# EAGLE schematic MAXREFDES98_Schematic (EAGLE 9.6.2)
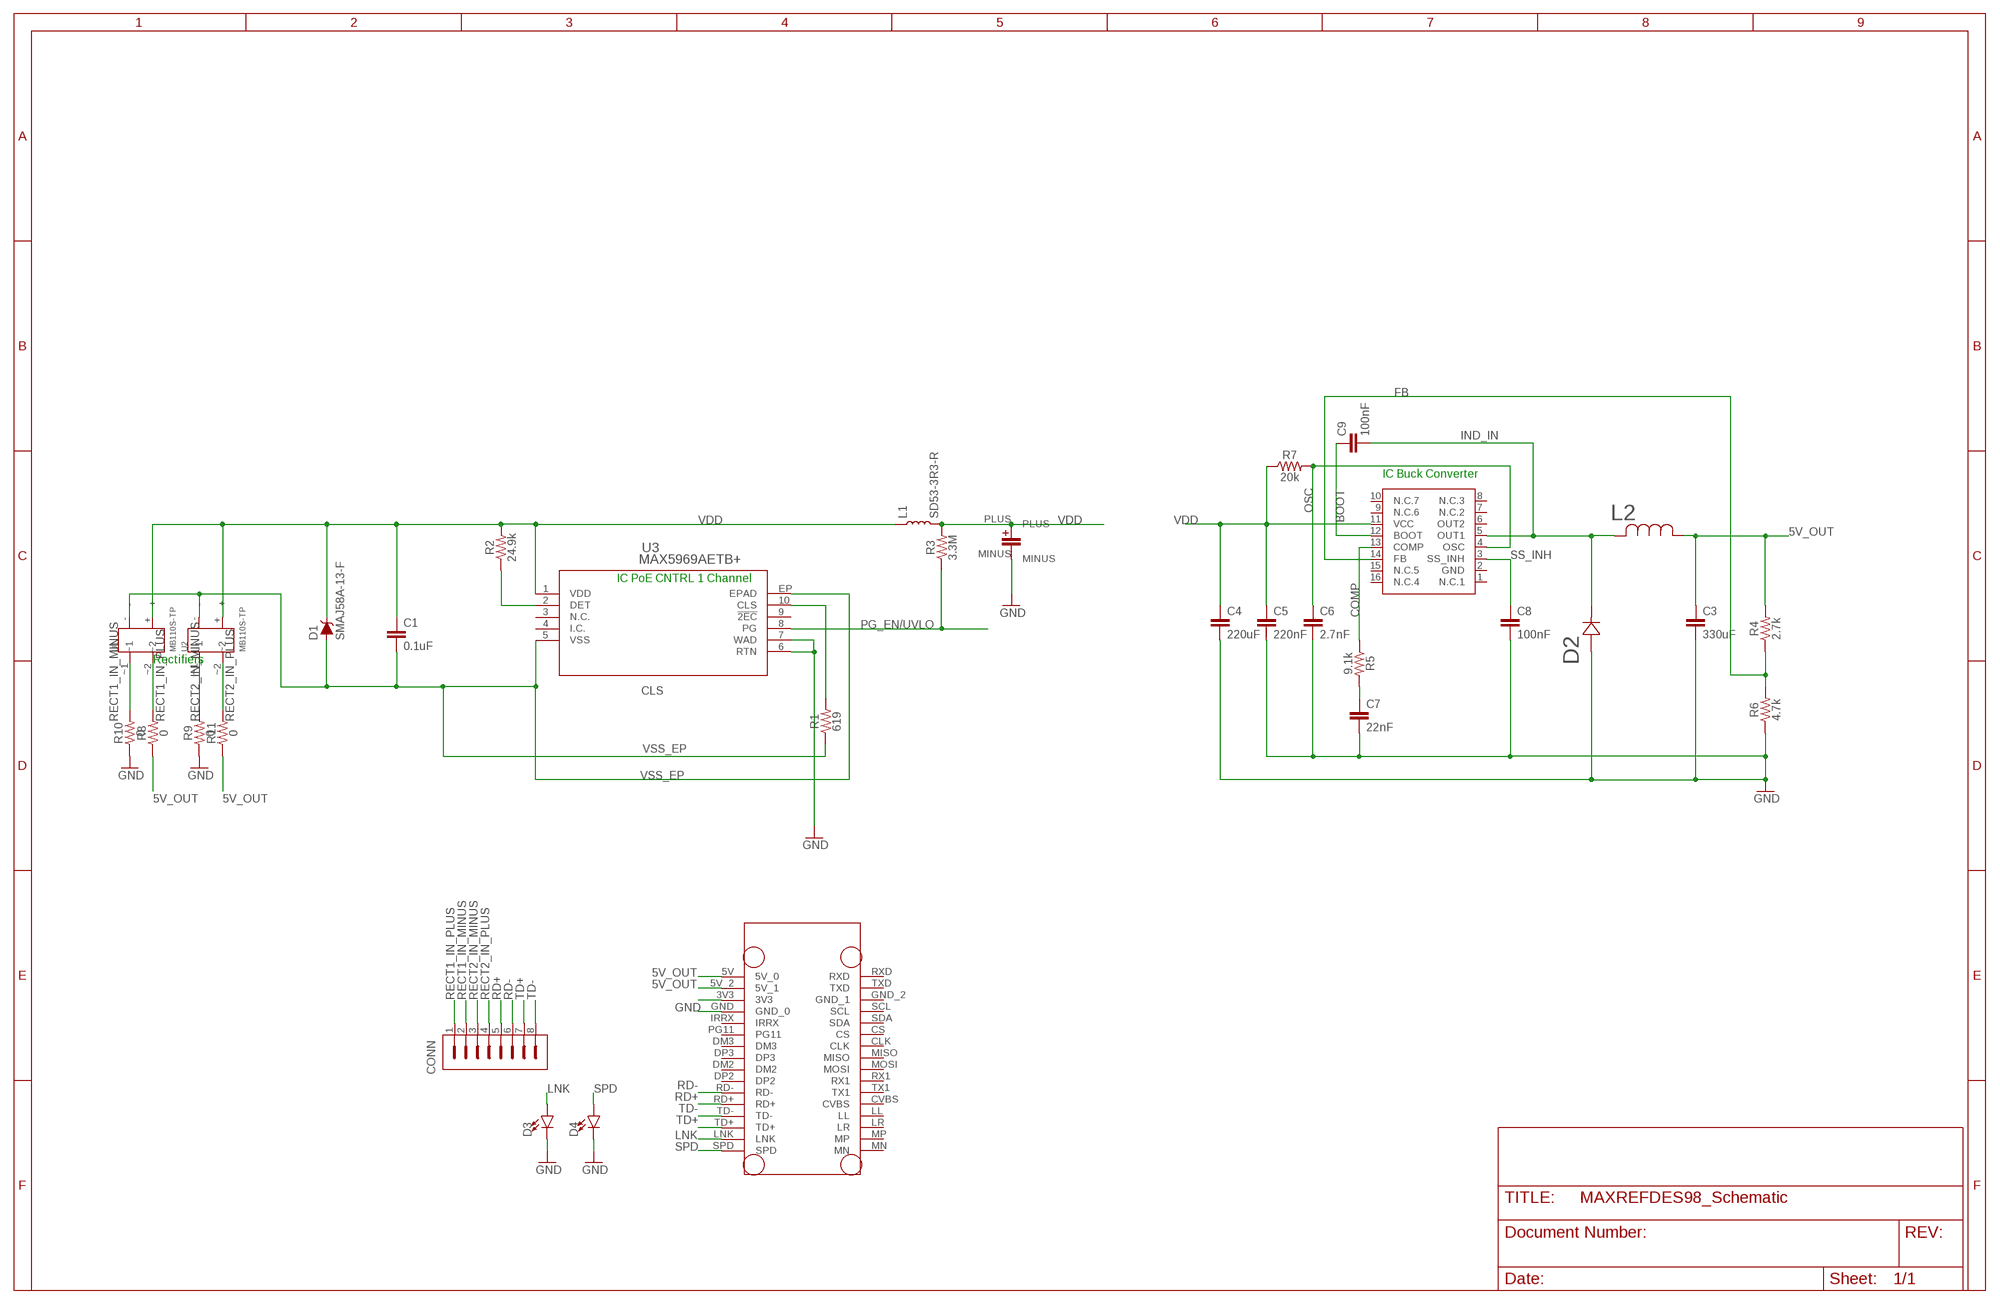
[diagram p0: schematic, sheet 1]

## Parts
C1  0.1uF  1.0UF-0805-25V-(+80/-20%)  [0805]
C2  EEE-1JA220UP  [EEE-1JA220UP]
C3  330uF  4.7UF0603  [0603]
C4  220uF  4.7UF0603  [0603]
C5  220nF  4.7UF0603  [0603]
C6  2.7nF  4.7UF0603  [0603]
C7  22nF  4.7UF0603  [0603]
C8  100nF  4.7UF0603  [0603]
C9  100nF  4.7UF0603  [0603]
CONN  TERM_BLOCK_PLUG_8POS_STR_2.5MM  [TERM_BLOCK_PLUG_8POS_STR_2.5MM]
D1  SMAJ58A-13-F  [SMAJ58A-13-F]
D2  STPS3L60USMB_STM-M  [SMB_STM-M]
D3  LED-FKIT-1206  [FKIT-LED-1206]
D4  LED-FKIT-1206  [FKIT-LED-1206]
L1  SD53-3R3-R  [SD53-3R3-R]
L2  SRR1806-151M  [IND_BOURNS_SRR1806]
R1  619  0.05OHM-0603-1/5W-1%  [0603]
R2  24.9k  0.05OHM-0603-1/5W-1%  [0603]
R3  3.3M  0.05OHM-0603-1/5W-1%  [0603]
R4  2.7k  0.22OHM-0805-1/4W-1%  [0805]
R5  9.1k  0.22OHM-0805-1/4W-1%  [0805]
R6  4.7k  0.22OHM-0805-1/4W-1%  [0805]
R7  20k  0.22OHM-0805-1/4W-1%  [0805]
R8  0  0OHM-0603-1/10W-5%  [0603]
R9  0  0OHM-0603-1/10W-5%  [0603]
R10  0  0OHM-0603-1/10W-5%  [0603]
R11  0  0OHM-0603-1/10W-5%  [0603]
U1  MB110S-TP  [MB110S-TP]
U2  MB110S-TP  [MB110S-TP]
U3  MAX5969AETB+  [MAX5969AETB+]
U$1  L4978D013TR  [L4978D013TR]
U$2  NANO_PI  [NANO_PI]

## Nets
5V_OUT: C3.1 L2.1 R4.2 R8.1 R11.1 U$2.5V(5V_0) U$2.5V_2(5V_1)
BOOT: C9.1 U$1.12(BOOT)
CLS: R1.2 U3.10(CLS)
COMP: R5.1 U$1.13(COMP)
DET: R2.1 U3.2(DET)
FB: R4.1 R6.2 U$1.14(FB)
GND: C2.MINUS C3.2 C4.2 C5.2 C6.2 C7.2 C8.2 D2.2 D3.C D4.C R6.1 R9.1 R10.1 U3.6(RTN) U3.7(WAD) U$2.GND(GND_0)
IND_IN: C9.2 D2.1 L2.2 U$1.5(OUT1)
LNK: D3.A U$2.LNK
N$6: C7.1 R5.2
N$8: U$2.3V3
OSC: C6.1 R7.2 U$1.4(OSC)
PG_EN/UVLO: R3.1 U3.8(PG)
RD+: CONN.5 U$2.RD+
RD-: CONN.6 U$2.RD-
RECT1_IN_MINUS: CONN.2 R10.2 U1.~1
RECT1_IN_PLUS: CONN.1 R8.2 U1.~2
RECT2_IN_MINUS: CONN.3 R9.2 U2.~1
RECT2_IN_PLUS: CONN.4 R11.2 U2.~2
SPD: D4.A U$2.SPD
SS_INH: C8.1 U$1.3(SS_INH)
TD+: CONN.7 U$2.TD+
TD-: CONN.8 U$2.TD-
VDD: C1.1 C2.PLUS C4.1 C5.1 D1.P$1 L1.P$1 L1.P$2 R2.2 R3.2 R7.1 U1.+ U2.+ U3.1(VDD) U$1.11(VCC)
VSS_EP: C1.2 D1.P$2 R1.1 U1.- U2.- U3.5(VSS) U3.EP(EPAD)
Unconnected: U3.3(N.C.) U3.4(I.C.) U3.9(!2EC) U$1.1(N.C.1) U$1.2(GND) U$1.6(OUT2) U$1.7(N.C.2) U$1.8(N.C.3) U$1.9(N.C.6) U$1.10(N.C.7) U$1.15(N.C.5) U$1.16(N.C.4) U$2.CLK U$2.CS U$2.CVBS U$2.DM2 U$2.DM3 U$2.DP2 U$2.DP3 U$2.GND_2(GND_1) U$2.IRRX U$2.LL U$2.LR U$2.MISO U$2.MN U$2.MOSI U$2.MP U$2.PG11 U$2.RX1 U$2.RXD U$2.SCL U$2.SDA U$2.TX1 U$2.TXD

## Notes on the sheet
- IC Buck Converter
- IC PoE CNTRL 1 Channel
- Rectifiers

## Library data of the parts
C1 = SparkFun-Capacitors:1.0UF: 1µF ceramic capacitors A capacitor is a passive two-terminal electrical component used to store electrical energy temporarily in an electric field.; PROD_ID: CAP-11625; VALUE: 1.0uF
C2 = EEE-1JA220UP:EEE-1JA220UP
C3-C9 = SparkFun-Capacitors:4.7UF: 4.7µF ceramic capacitors A capacitor is a passive two-terminal electrical component used to store electrical energy temporarily in an electric field.; PROD_ID: CAP-08280; VALUE: 4.7uF
CONN = Camera_Board_Parts_09_30_2020:TERM_BLOCK_PLUG_8POS_STR_2.5MM
D1 = SMAJ58A-13-F:SMAJ58A-13-F
D2 = Camera_Board_Parts_09_30_2020:STPS3L60U; BUILT_BY: EMA_UL_Team; MANUFACTURER_PART_NUMBER: STPS3L60U; SOURCELIBRARY: StMicro_2011-06-07; VENDOR: STMicroelectronics
D3 D4 = SparkFun-LED:LED: LED (Generic) Standard schematic elements and footprints for 5mm, 3mm, 1206, and 0603 sized LEDs. Generic LEDs with no color specified.
L1 = SD53-3R3-R:SD53-3R3-R
L2 = Camera_Board_Parts_09_30_2020:SRR1806-151M; BUILT_BY: EMA_UL_Team; MANUFACTURER_PART_NUMBER: SRR1806-151M; SOURCELIBRARY: Bourns_2010-01-01_IND_SRRxxxx; VENDOR: Bourns Electronics
R1-R3 = SparkFun-Resistors:0.05OHM: 0.05Ω resistor A resistor is a passive two-terminal electrical component that implements electrical resistance as a circuit element. Resistors act to reduce current flow, and, at the same time, act to lower voltage levels within circuits. - Wikipedia; PROD_ID: RES-12535; VALUE: 0.05
R4-R7 = SparkFun-Resistors:0.22OHM: 0.22Ω resistor A resistor is a passive two-terminal electrical component that implements electrical resistance as a circuit element. Resistors act to reduce current flow, and, at the same time, act to lower voltage levels within circuits. - Wikipedia; PROD_ID: RES-09883; VALUE: 0.22
R8-R11 = SparkFun-Resistors:0OHM: 0Ω resistor A resistor is a passive two-terminal electrical component that implements electrical resistance as a circuit element. Resistors act to reduce current flow, and, at the same time, act to lower voltage levels within circuits. - Wikipedia; PROD_ID: RES-08609
U1 U2 = MB110S-TP:MB110S-TP
U3 = MAX5969AETB+_Library:MAX5969AETB+
U$1 = Camera_Board_Parts_09_30_2020:L4978D013TR
U$2 = Camera_Board_Parts_09_30_2020:NANO_PI